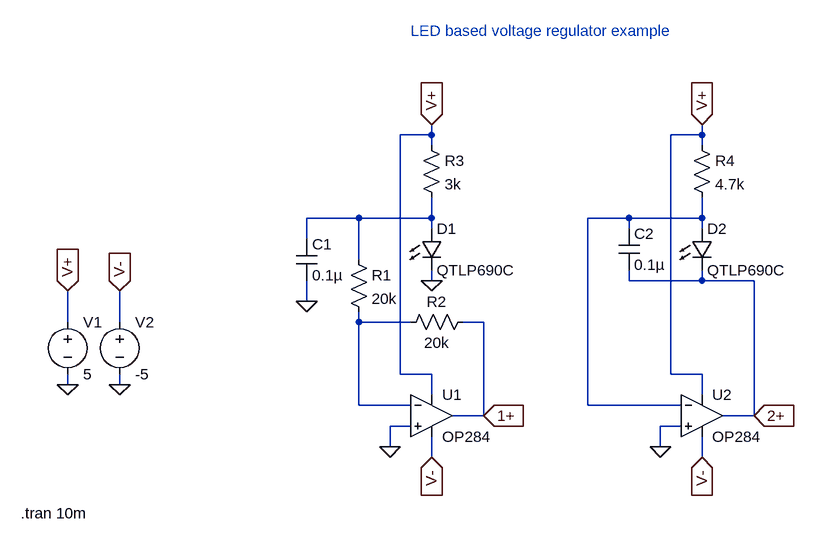
[diagram p0: schematic led_based_volt_reg.asc]
led_based_volt_reg.asc, the LTspice schematic file:
Version 4
SHEET 1 880 680
WIRE 112 -256 112 -272
WIRE 112 -256 64 -256
WIRE 528 -256 528 -272
WIRE 528 -256 480 -256
WIRE 112 -240 112 -256
WIRE 528 -240 528 -256
WIRE 0 -128 -80 -128
WIRE 112 -128 112 -160
WIRE 112 -128 0 -128
WIRE 416 -128 352 -128
WIRE 528 -128 528 -160
WIRE 528 -128 416 -128
WIRE 112 -112 112 -128
WIRE 416 -112 416 -128
WIRE 528 -112 528 -128
WIRE -80 -96 -80 -128
WIRE 0 -64 0 -128
WIRE 112 -32 112 -48
WIRE 416 -32 416 -48
WIRE 528 -32 528 -48
WIRE 528 -32 416 -32
WIRE 608 -32 528 -32
WIRE -80 0 -80 -32
WIRE -448 32 -448 -16
WIRE -368 32 -368 -16
WIRE 0 32 0 16
WIRE 80 32 0 32
WIRE 192 32 160 32
WIRE 64 112 64 -256
WIRE 112 112 64 112
WIRE 480 112 480 -256
WIRE 528 112 480 112
WIRE -448 128 -448 112
WIRE -368 128 -368 112
WIRE 112 144 112 112
WIRE 528 144 528 112
WIRE 0 160 0 32
WIRE 80 160 0 160
WIRE 352 160 352 -128
WIRE 496 160 352 160
WIRE 192 176 192 32
WIRE 192 176 144 176
WIRE 608 176 608 -32
WIRE 608 176 560 176
WIRE 80 192 48 192
WIRE 496 192 464 192
WIRE 48 224 48 192
WIRE 464 224 464 192
WIRE 112 240 112 208
WIRE 528 240 528 208
FLAG 48 224 0
FLAG -448 128 0
FLAG -448 -16 V+
IOPIN -448 -16 In
FLAG -368 128 0
FLAG -368 -16 V-
IOPIN -368 -16 In
FLAG 112 -272 V+
IOPIN 112 -272 In
FLAG 112 -32 0
FLAG -80 0 0
FLAG 112 240 V-
IOPIN 112 240 In
FLAG 464 224 0
FLAG 528 -272 V+
IOPIN 528 -272 In
FLAG 528 240 V-
IOPIN 528 240 In
FLAG 192 176 1+
IOPIN 192 176 In
FLAG 608 176 2+
IOPIN 608 176 In
SYMBOL Opamps\\OP284 112 112 R0
SYMATTR InstName U1
SYMBOL voltage -448 16 R0
WINDOW 123 0 0 Left 0
WINDOW 39 0 0 Left 0
SYMATTR InstName V1
SYMATTR Value 5
SYMBOL voltage -368 16 R0
WINDOW 123 0 0 Left 0
WINDOW 39 0 0 Left 0
SYMATTR InstName V2
SYMATTR Value -5
SYMBOL res 96 -256 R0
SYMATTR InstName R3
SYMATTR Value 3k
SYMBOL LED 96 -112 R0
SYMATTR InstName D1
SYMATTR Value QTLP690C
SYMATTR Description Diode
SYMATTR Type diode
SYMBOL res -16 -80 R0
SYMATTR InstName R1
SYMATTR Value 20k
SYMBOL cap -96 -96 R0
SYMATTR InstName C1
SYMATTR Value 0.1µ
SYMBOL res 176 16 R90
WINDOW 0 0 56 VBottom 2
WINDOW 3 32 56 VTop 2
SYMATTR InstName R2
SYMATTR Value 20k
SYMBOL Opamps\\OP284 528 112 R0
SYMATTR InstName U2
SYMBOL res 512 -256 R0
SYMATTR InstName R4
SYMATTR Value 4.7k
SYMBOL LED 512 -112 R0
SYMATTR InstName D2
SYMATTR Value QTLP690C
SYMATTR Description Diode
SYMATTR Type diode
SYMBOL cap 400 -112 R0
SYMATTR InstName C2
SYMATTR Value 0.1µ
TEXT -520 326 Left 2 !.tran 10m
TEXT 80 -416 Left 2 ;LED based voltage regulator example

The netlist it stands for:
* led_based_volt_reg.asc
XU1 0 N003 V+ V- 1+ OP284  ; pins In+ In- V+ V- OUT
V1 V+ 0 5
V2 V- 0 -5
R3 V+ N001 3k
D1 N001 0 QTLP690C
R1 N001 N003 20k
C1 N001 0 0.1µ
R2 1+ N003 20k
XU2 0 N002 V+ V- 2+ OP284  ; pins In+ In- V+ V- OUT
R4 V+ N002 4.7k
D2 N002 2+ QTLP690C
C2 N002 2+ 0.1µ
.model D D
.lib standard.dio
.tran 10m
* LED based voltage regulator example
.lib ADI1.lib
.backanno
.end